# EAGLE design ARC Shield 0.2 (EAGLE 6.4)
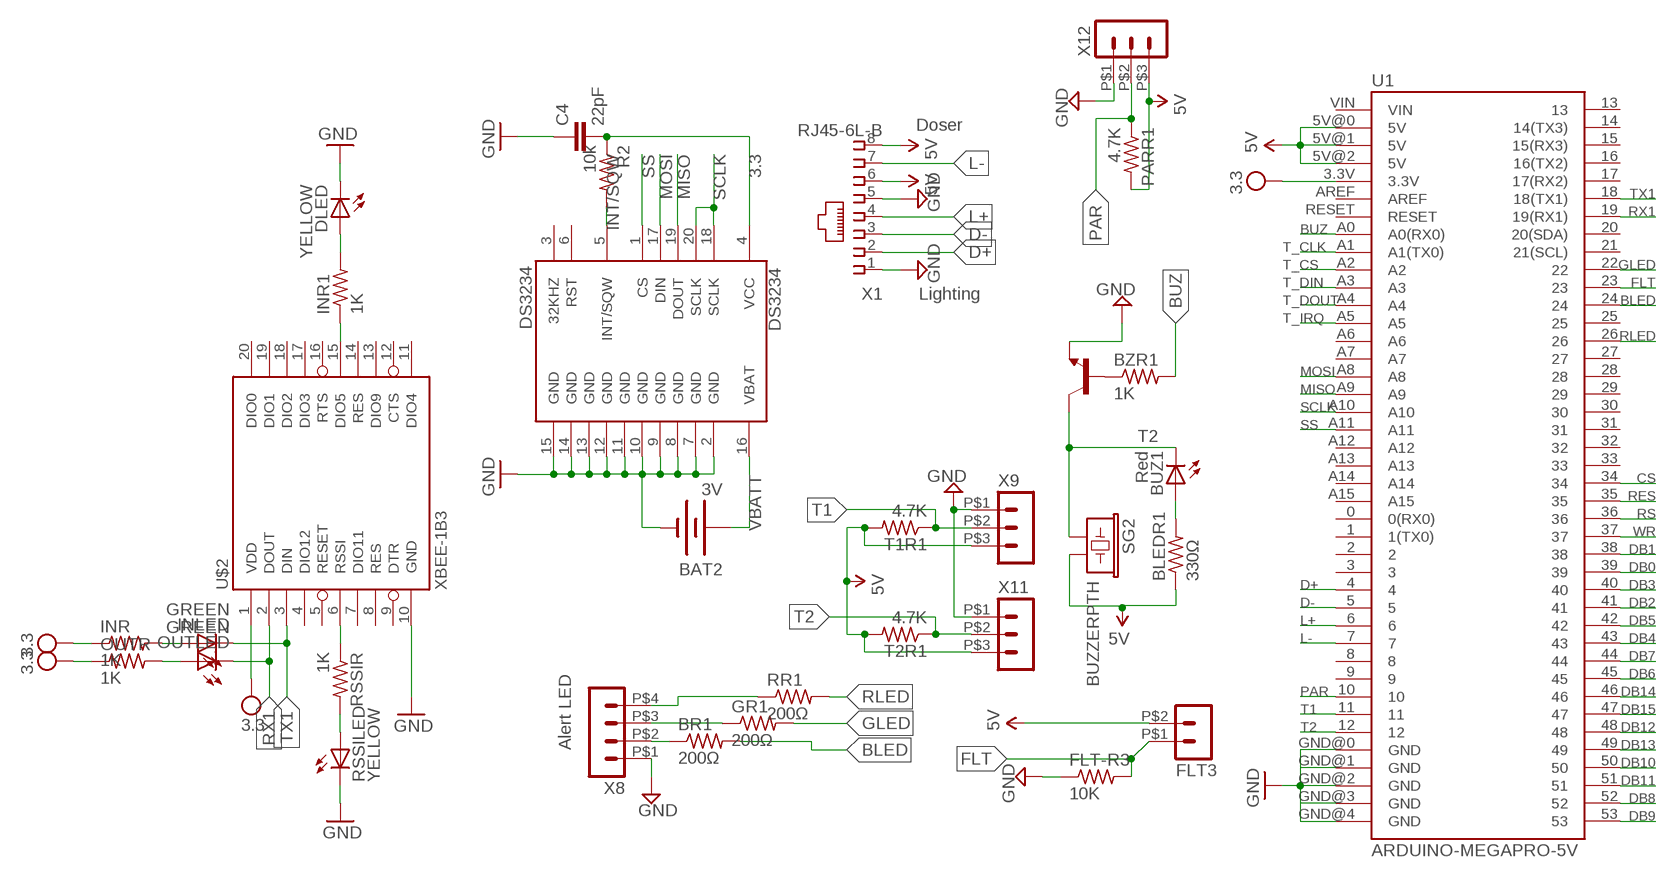
[diagram p0: schematic, sheet 1]

## Parts
BAT2  3V  BATTERY  [BATTCON_12MM_CURVED]
BLEDR1  330Ω  R-US_0204/7  [0204/7]
BR1  200Ω  R-US_0204/7  [0204/7]
BUZ1  Red  LED3MM  [LED3MM]
BZR1  1K  R-US_0204/7  [0204/7]
C4  22pF  C5/3  [C5B3]
DLED  YELLOW  LED3MM  [LED3MM]
DS3234  DS3234  [DS3234]
FLT3  HEADER_POS2_43045-0200  [43045-0200]
FLT-R3  10K  R-US_0204/7  [0204/7]
GR1  200Ω  R-US_0204/7  [0204/7]
INLED  GREEN  LED3MM  [LED3MM]
INR  1K  R-US_0204/7  [0204/7]
INR1  1K  R-US_0204/7  [0204/7]
OUTLED  GREEN  LED3MM  [LED3MM]
OUTR  1K  R-US_0204/7  [0204/7]
PARR1  4.7K  R-US_0204/7  [0204/7]
R2  10k  R-US_0204/7  [0204/7]
RR1  200Ω  R-US_0204/7  [0204/7]
RSSILED  YELLOW  LED3MM  [LED3MM]
RSSIR  1K  R-US_0204/7  [0204/7]
SG2  BUZZERPTH  [BUZZER-12MM]
T1R1  4.7K  R-US_0204/7  [0204/7]
T2  -NPN-TO92  [TO92]
T2R1  4.7K  R-US_0204/7  [0204/7]
U1  ARDUINO-MEGAPRO-5V  [ARDUINO_MEGA-PRO-5V]
U$2  XBEE-1B3  [XBEE-SMD]
X1  RJ45-6L-B  [RJ45-NO-SHIELD]
X8  HEADER_POS4_43045-0401  [43045-0400]
X9  HEADER_POS3_43650-0300  [43650-0300]
X11  HEADER_POS3_43650-0300  [43650-0300]
X12  HEADER_POS3_43650-0300  [43650-0300]

## Nets
3.3: C4.2 DS3234.4(VCC) R2.1 U$2.1(VDD)
5V [1A]: BLEDR1.1 FLT3.P$2 PARR1.2 SG2.- T1R1.2 T2R1.2 U1.5V@0(5V) U1.5V@1(5V) U1.5V@2(5V) X1.6 X1.8 X9.P$3 X11.P$3 X12.P$3
BLED: BR1.2 U1.24
BUZ: BZR1.2 U1.A0(A0(RX0))
CS: U1.34
D+: U1.4 X1.2
D-: U1.5 X1.3
DB0: U1.39
DB1: U1.38
DB2: U1.41
DB3: U1.40
DB4: U1.43
DB5: U1.42
DB6: U1.45
DB7: U1.44
DB8: U1.52
DB9: U1.53
DB10: U1.50
DB11: U1.51
DB12: U1.48
DB13: U1.49
DB14: U1.46
DB15: U1.47
FLT: FLT3.P$1 FLT-R3.2 U1.23
GLED: GR1.2 U1.22
GND [1A]: BAT2.GND(-) C4.1 DLED.K(C) DS3234.2(GND) DS3234.7(GND) DS3234.8(GND) DS3234.9(GND) DS3234.10(GND) DS3234.11(GND) DS3234.12(GND) DS3234.13(GND) DS3234.14(GND) DS3234.15(GND) FLT-R3.1 RSSILED.K(C) T2.1(E) U1.GND@0(GND) U1.GND@1(GND) U1.GND@2(GND) U1.GND@3(GND) U1.GND@4(GND) U$2.10(GND) X1.1 X1.5 X8.P$1 X9.P$1 X11.P$1 X12.P$1
INT/SQW: DS3234.5(INT/SQW) R2.2
L+: U1.6 X1.4
L-: U1.7 X1.7
MISO: DS3234.19(DOUT) U1.A9
MOSI: DS3234.17(DIN) U1.A8
N$1: BR1.1 X8.P$2
N$2: BUZ1.K(C) SG2.+ T2.3(C)
N$3: BZR1.1 T2.2(B)
N$4: RSSIR.1 U$2.6(RSSI)
N$5: GR1.1 X8.P$3
N$6: RSSILED.A RSSIR.2
N$7: RR1.1 X8.P$4
N$11: INLED.A INR.2
N$12: OUTLED.A OUTR.2
N$14: DLED.A INR1.2
N$15: INR1.1 U$2.15(DIO5)
N$19: BLEDR1.2 BUZ1.A
PAR: PARR1.1 U1.10 X12.P$2
RES: U1.35
RLED: RR1.2 U1.26
RS: U1.36
RX1: OUTLED.K(C) U1.19(19(RX1)) U$2.2(DOUT)
SCLK: DS3234.18(SCLK) DS3234.20(SCLK) U1.A10
SS: DS3234.1(CS) U1.A11
T1: T1R1.1 U1.11 X9.P$2
T2: T2R1.1 U1.12 X11.P$2
T_CLK: U1.A1(A1(TX0))
T_CS: U1.A2
T_DIN: U1.A3
T_DOUT: U1.A4
T_IRQ: U1.A5
TX1: INLED.K(C) U1.18(18(TX1)) U$2.3(DIN)
VBATT: BAT2.PWR@1(+) DS3234.16(VBAT)
VCC [1A]: INR.1 OUTR.1 U1.3.3V ; supply symbol labelled 3.3
WR: U1.37
Unconnected: DS3234.3(32KHZ) DS3234.6(RST) U1.0(0(RX0)) U1.1(1(TX0)) U1.2 U1.3 U1.8 U1.9 U1.13 U1.14(14(TX3)) U1.15(15(RX3)) U1.16(16(TX2)) U1.17(17(RX2)) U1.20(20(SDA)) U1.21(21(SCL)) U1.25 U1.27 U1.28 U1.29 U1.30 U1.31 U1.32 U1.33 U1.A6 U1.A7 U1.A12 U1.A13 U1.A14 U1.A15 U1.AREF U1.RESET U1.VIN U$2.4(DIO12) U$2.5(RESET) U$2.7(DIO11) U$2.8(RES) U$2.9(DTR) U$2.11(DIO4) U$2.12(CTS) U$2.13(DIO9) U$2.14(RES) U$2.16(RTS) U$2.17(DIO3) U$2.18(DIO2) U$2.19(DIO1) U$2.20(DIO0)

## Notes on the sheet
- Doser
- Lighting
- Alert LED

## Library data of the parts
BAT2 = SparkFun:BATTERY: Battery Holders Various common sizes : AA, AAA, 20mm coin cell and 12mm coin cell.
BLEDR1 BR1 BZR1 FLT-R3 GR1 INR INR1 OUTR PARR1 R2 RR1 RSSIR T1R1 T2R1 = rcl:R-US_: RESISTOR, American symbol
BUZ1 DLED INLED OUTLED RSSILED = led:LED: LED OSRAM: - CHIPLED LG R971, LG N971, LY N971, LG Q971, LY Q971, LO R971, LY R971 LH N974, LH R974 LS Q976, LO Q976, LY Q976 LO Q996 - Hyper CHIPLED LW Q18S LB Q993, LB Q99A, LB R99A - SideLED LS A670, LO A670, LY A670, LG A670, LP A670 LB A673, LV A673, LT A673, LW A673 LH A674 LY A675 LS A676, LA A676, LO A676, LY A676, LW A676 LS A679, LY A679, LG A679 - Hyper Micro SIDELED® LS Y876, LA Y876, LO Y876, LY Y876 LT Y87S - SmartLED LW L88C, LW L88S LB L89C, LB L89S, LG L890 LS L89K, LO L89K, LY L89K LS L896, LA L896, LO L896, LY L896 - TOPLED LS T670, LO T670, LY T670, LG T670, LP T670 LSG T670, LSP T670, LSY T670, LOP T670, LYG T670 LG T671, LOG T671, LSG T671 LB T673, LV T673, LT T673, LW T673 LH T674 LS T676, LA T676, LO T676, LY T676, LB T676, LH T676, LSB T676, LW T676 LB T67C, LV T67C, LT T67C, LS T67K, LO T67K, LY T67K, LW E67C LS E67B, LA E67B, LO E67B, LY E67B, LB E67C, LV E67C, LT E67C LW T67C LS T679, LY T679, LG T679 LS T770, LO T770, LY T770, LG T770, LP T770 LB T773, LV T773, LT T773, LW T773 LH T774 LS E675, LA E675, LY E675, LS T675 LS T776, LA T776, LO T776, LY T776, LB T776 LHGB T686 LT T68C, LB T68C - Hyper Mini TOPLED® LB M676 - Mini TOPLED Santana® LG M470 LS M47K, LO M47K, LY M47K Source: http://www.osram.convergy.de LUXEON: - LUMILED® LXK2-PW12-R00, LXK2-PW12-S00, LXK2-PW14-U00, LXK2-PW14-V00 LXK2-PM12-R00, LXK2-PM12-S00, LXK2-PM14-U00 LXK2-PE12-Q00, LXK2-PE12-R00, LXK2-PE12-S00, LXK2-PE14-T00, LXK2-PE14-U00 LXK2-PB12-K00, LXK2-PB12-L00, LXK2-PB12-M00, LXK2-PB14-N00, LXK2-PB14-P00, LXK2-PB14-Q00 LXK2-PR12-L00, LXK2-PR12-M00, LXK2-PR14-Q00, LXK2-PR14-R00 LXK2-PD12-Q00, LXK2-PD12-R00, LXK2-PD12-S00 LXK2-PH12-R00, LXK2-PH12-S00 LXK2-PL12-P00, LXK2-PL12-Q00, LXK2-PL12-R00 Source: www.luxeon.com KINGBRIGHT: KA-3528ASYC Source: www.kingbright.com
C4 = capacitor-wima:C: CAPACITOR naming: grid - package width
DS3234 = SparkFun:DS3234: DS3234 Real Time Clock
FLT3 = con-molex-micro-fit-3_0:HEADER_POS2_?: Molex - Micro-Fit 3.0 Series connector, 3.00mm (0.118") pitch header, 2 positions.
SG2 = SparkFun-Electromechanical:BUZZER: Buzzer 12mm Spark Fun Electronics SKU : Comp-Buzzer
T2 = transistor:*-NPN-: NPN Transistror BF959 corrected 2008.03.06
U1 = SparkFun-Boards:ARDUINO-MEGA: Arduino Mega board footprint
U$2 = SparkFun-RF:XBEE-1: Xbee module footprints SMT header is CONN-09042.; PROD_ID: CONN-09042
X1 = con-tycoelectronics:RJ45: CORCOM Modular RJ Jacks No Shield Source: www.tycoelectronics.com .. ENG_DS_1654001_1099_RJ_L_0507.pdf; MPN: RJ45-6L-B; OC_FARNELL: unknown; OC_NEWARK: 16R6090
X8 = con-molex-micro-fit-3_0:HEADER_POS4_?: Molex - Micro-Fit 3.0 Series connector, 3.00mm (0.118") pitch header, 4 positions.
X9 X11 X12 = con-molex-micro-fit-3_0:HEADER_POS3_?: Molex - Micro-Fit 3.0 Series connector, 3.00mm (0.118") pitch header, 3 positions.

## Net classes
0 default: width 0.457 mm, clearance 0.406 mm
2 1A: width 0.66 mm, clearance 0.406 mm

## Board
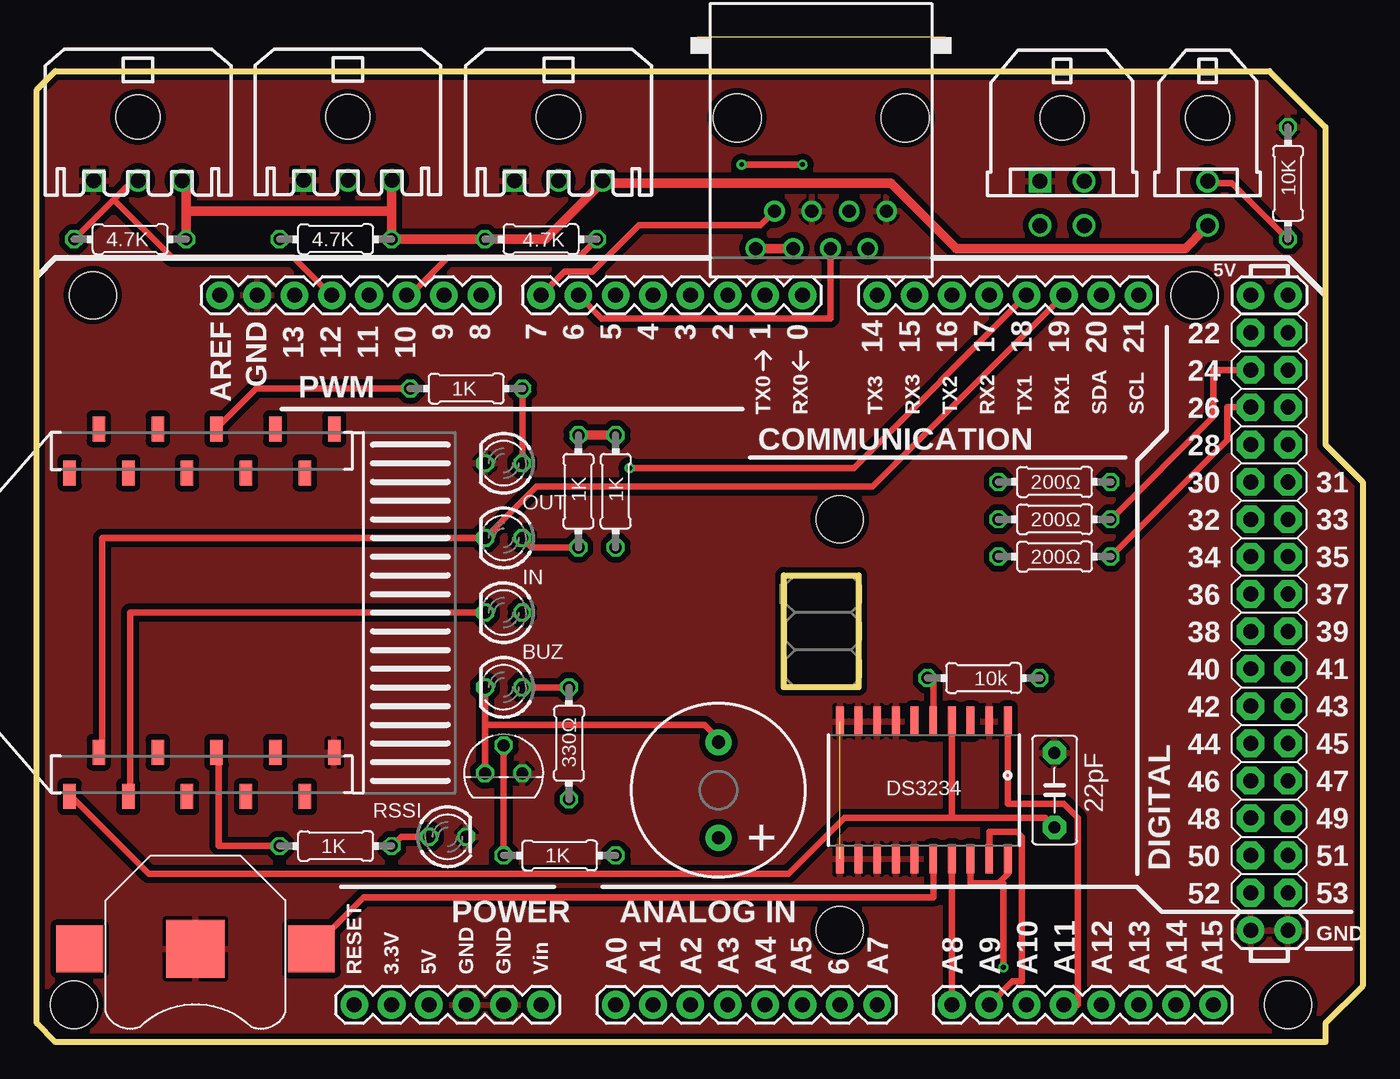
[diagram p1: board, top side]
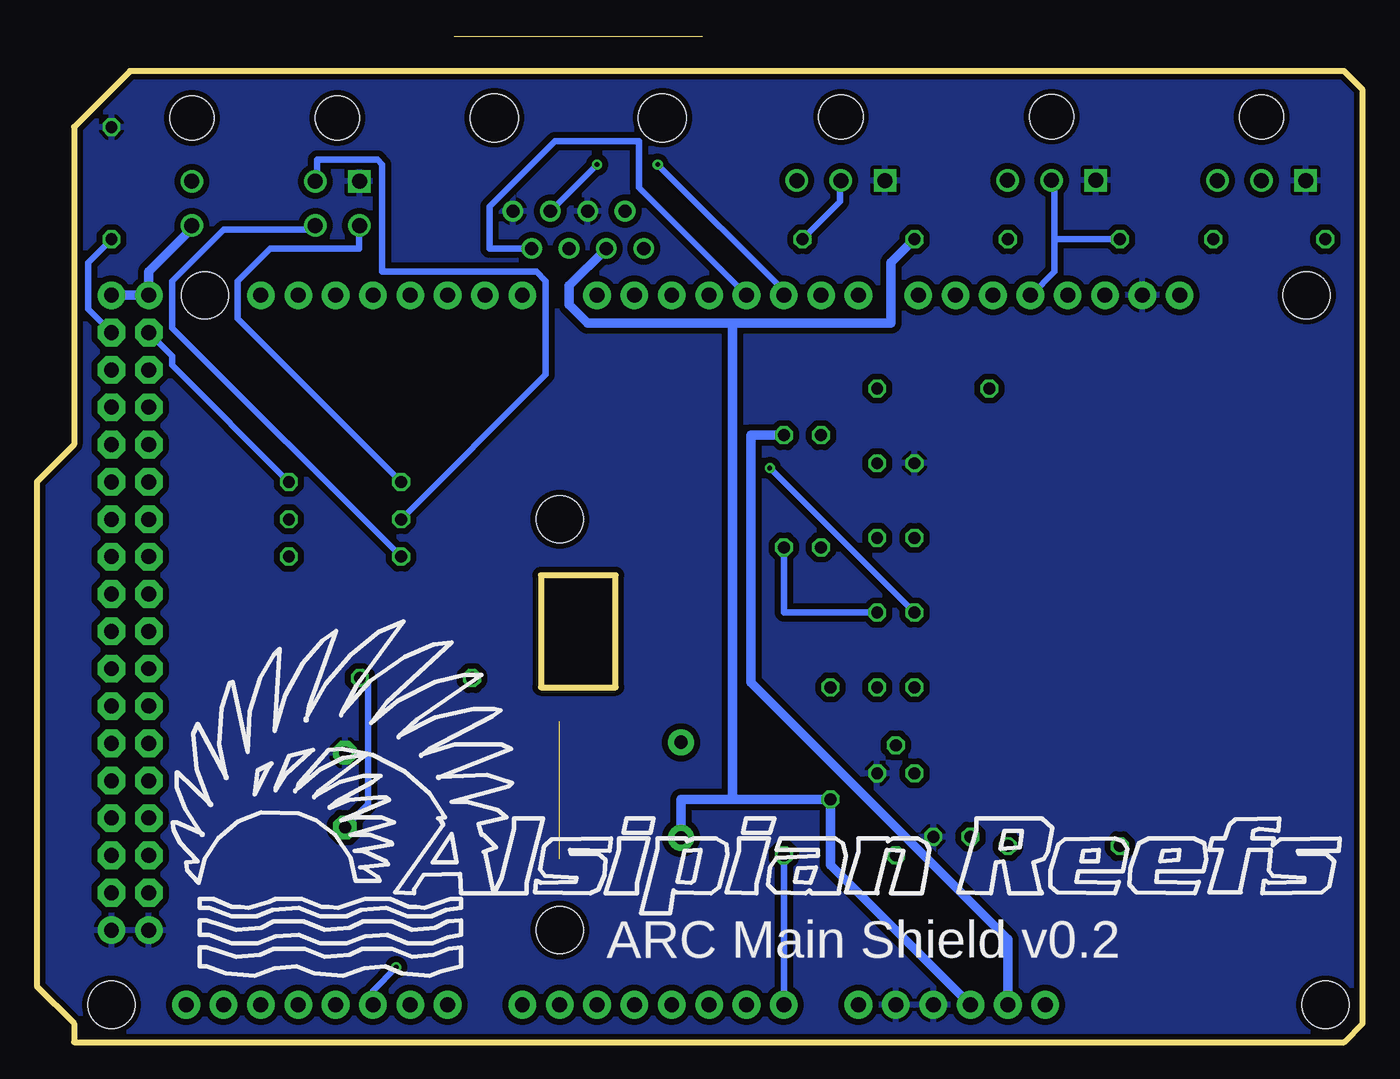
[diagram p2: board, bottom side, seen from below]

Size 90.17 x 66.04 mm. Coordinates in mm from the lower left corner, seen from the top.
Outline: 1.27,0 0,1.27 0,64.77 1.27,66.04 83.82,66.04 87.63,62.23 87.63,40.64 90.17,38.1 90.17,3.81 87.63,1.27 87.63,0 1.27,0
Outline: 50.8,31.75 55.88,31.75 55.88,24.13 50.8,24.13 50.8,31.75
Copper layers (1*16): Top 0.0356mm / dielectric 1.5011mm / Bottom 0.0356mm
Design rules "LaenPCBOrder": minimum track width 6mil, minimum drill 13mil, track to track 6mil, track to pad 6mil, pad to pad 6mil, via to via 6mil, smd to smd 6mil, copper to edge 15mil, drill to drill 6mil, minimum pad ring 7mil, minimum via ring 7mil, stop-mask expansion 3mil, vias tented up to drill 0mil, thermal gap 10mil

### Footprints (pad centres in the part's own frame; a part is rotated, then mirrored left to right if it is on the bottom)
BATTCON_12MM_CURVED = smd 3.962 x 3.962: GND 0,0 | smd 3.175 x 3.175: PWR@1 -7.874,0; PWR@2 7.874,0
0204/7 = drill 0.813 octagon: 1 -3.81,0; 2 3.81,0
LED3MM = drill 0.813 octagon: A -1.27,0; K 1.27,0
C5B3 = drill 0.813 pad 1.6 octagon: 1 -2.54,0; 2 2.54,0
DS3234 = smd 0.53 x 1.98: 1 -5.715,-4.685; 2 -4.445,-4.685; 3 -3.175,-4.685; 4 -1.905,-4.685; 5 -0.635,-4.685; 6 0.635,-4.685; 7 1.905,-4.685; 8 3.175,-4.685; 9 4.445,-4.685; 10 5.715,-4.685; 11 5.715,4.685; 12 4.445,4.685; 13 3.175,4.685; 14 1.905,4.685; 15 0.635,4.685; 16 -0.635,4.685; 17 -1.905,4.685; 18 -3.175,4.685; 19 -4.445,4.685; 20 -5.715,4.685
43045-0200 = drill 1.02: P$1 0,4.32; P$2 0,7.32 | hole 3: 0,0
BUZZER-12MM = drill 0.9 pad 1.778: + 3.25,0; - -3.25,0
TO92 = drill 0.813 octagon: 1 1.27,0; 2 0,1.905; 3 -1.27,0
ARDUINO_MEGA-PRO-5V = drill 1.016 pad 1.88: 0 52.07,50.8; 1 49.53,50.8; 2 46.99,50.8; 3 44.45,50.8; 3.3V 24.13,2.54; 4 41.91,50.8; 5 39.37,50.8; 5V@0 26.67,2.54; 5V@1 82.55,50.8; 5V@2 85.09,50.8; 6 36.83,50.8; 7 34.29,50.8; 8 30.226,50.8; 9 27.686,50.8; 10 25.146,50.8; 11 22.606,50.8; 12 20.066,50.8; 13 17.526,50.8; 14 57.15,50.8; 15 59.69,50.8; 16 62.23,50.8; 17 64.77,50.8; 18 67.31,50.8; 19 69.85,50.8; 20 72.39,50.8; 21 74.93,50.8; A0 39.37,2.54; A1 41.91,2.54; A2 44.45,2.54; A3 46.99,2.54; A4 49.53,2.54; A5 52.07,2.54; A6 54.61,2.54; A7 57.15,2.54; A8 62.23,2.54; A9 64.77,2.54; A10 67.31,2.54; A11 69.85,2.54; A12 72.39,2.54; A13 74.93,2.54; A14 77.47,2.54; A15 80.01,2.54; AREF 12.446,50.8; GND@0 29.21,2.54; GND@1 31.75,2.54; GND@2 82.55,7.62; GND@3 85.09,7.62; GND@4 14.986,50.8; RESET 21.59,2.54; VIN 34.29,2.54 | drill 1.016 pad 1.88 octagon: 22 82.55,48.26; 23 85.09,48.26; 24 82.55,45.72; 25 85.09,45.72; 26 82.55,43.18; 27 85.09,43.18; 28 82.55,40.64; 29 85.09,40.64; 30 82.55,38.1; 31 85.09,38.1; 32 82.55,35.56; 33 85.09,35.56; 34 82.55,33.02; 35 85.09,33.02; 36 82.55,30.48; 37 85.09,30.48; 38 82.55,27.94; 39 85.09,27.94; 40 82.55,25.4; 41 85.09,25.4; 42 82.55,22.86; 43 85.09,22.86; 44 82.55,20.32; 45 85.09,20.32; 46 82.55,17.78; 47 85.09,17.78; 48 82.55,15.24; 49 85.09,15.24; 50 82.55,12.7; 51 85.09,12.7; 52 82.55,10.16; 53 85.09,10.16 | hole 3.2: 3.81,50.8; 2.54,2.54; 54.61,35.56; 54.61,7.62; 78.74,50.8; 85.09,2.54
XBEE-SMD = smd 1.7 x 0.85: 1 -12.5,20; 2 -9.5,18; 3 -12.5,16; 4 -9.5,14; 5 -12.5,12; 6 -9.5,10; 7 -12.5,8; 8 -9.5,6; 9 -12.5,4; 10 -9.5,2; 11 12.5,2; 12 9.5,4; 13 12.5,6; 14 9.5,8; 15 12.5,10; 16 9.5,12; 17 12.5,14; 18 9.5,16; 19 12.5,18; 20 9.5,20
RJ45-NO-SHIELD = drill 0.9 pad 1.4: 1 -4.445,6.35; 2 -3.175,8.89; 3 -1.905,6.35; 4 -0.635,8.89; 5 0.635,6.35; 6 1.905,8.89; 7 3.175,6.35; 8 4.445,8.89 | hole 3.251: -5.715,0; 5.715,0
43045-0400 = drill 1.02 square: P$1 1.5,4.32 | drill 1.02: P$2 -1.5,4.32; P$3 1.5,7.32; P$4 -1.5,7.32 | hole 3: 0,0
43650-0300 = drill 1.02 square: P$1 3,4.32 | drill 1.02: P$2 0,4.32; P$3 -3,4.32 | hole 3: 0,0

### Placement (x,y rotation side)
BAT2  10.79,6.35 180 top
BLEDR1  36.2,20.32 90 top
BR1  69.22,35.56 0 top
BUZ1  31.75,24.13 180 top
BZR1  35.56,12.7 0 top
C4  69.22,17.14 270 top
DLED  31.75,39.37 180 top
DS3234  60.33,17.14 180 top
FLT3  79.63,62.87 180 top
FLT-R3  85.09,58.42 270 top
GR1  69.22,38.1 0 top
INLED  31.75,29.21 180 top
INR  39.37,37.47 270 top
INR1  29.21,44.45 0 top
OUTLED  31.75,34.29 180 top
OUTR  36.83,37.47 270 top
PARR1  34.29,54.61 180 top
R2  64.39,24.77 180 top
RR1  69.22,33.02 0 top
RSSILED  27.94,13.97 0 top
RSSIR  20.32,13.34 0 top
SG2  46.35,17.14 90 top
T1R1  20.32,54.61 0 top
T2  31.75,18.29 0 top
T2R1  6.35,54.61 0 top
U1  0,0 0 top
U$2  22.23,29.21 90 top
X1  53.34,62.87 180 top
X8  69.72,62.87 180 top
X9  21.16,62.94 180 top
X11  6.88,62.92 180 top
X12  35.48,62.92 180 top

### Tracks (layer width: path | path; a pad name or v marks a point on that pad's centre or on a via)
3.3
  Top 0.457: 62.23,15.24 68.58,15.24 C4.2 | 62.23,15.24 54.93,15.24 51.12,11.43 7.62,11.43 2.54,16.51 U$2.1 | 62.23,15.24 DS3234.4
  Bottom 0.457: C4.2 67.63,16.19 67.63,24.45 67.94,24.77 R2.1
5V
  Top 0.66: 10.16,56.52 10.16,58.42 X11.P$3 | 10.16,56.52 T2R1.2 | X1.6 X1.8 | 24.13,56.52 24.13,58.42 X9.P$3 | 24.13,56.52 T1R1.2 PARR1.2 34.61,54.61 38.42,58.42 X12.P$3 38.73,58.42 58.1,58.42 62.55,53.98 78.11,53.98 79.38,55.24 FLT3.P$2 | 24.13,56.52 10.16,56.52
  Bottom 0.66: 42.86,16.51 46.35,16.51 SG2.- | 42.86,16.51 BLEDR1.1 36.2,12.06 U1.5V@0 | FLT3.P$2 79.69,55.24 82.55,52.39 U1.5V@1 U1.5V@2 | X1.6 53.98,51.44 53.98,50.16 52.7,48.9 42.86,48.9 | 42.86,48.9 32.07,48.9 32.07,53.02 PARR1.2 | 42.86,48.9 42.86,16.51
BLED
  Top 0.457: BR1.2 80.01,42.55 80.01,45.72 U1.24
BUZ
  Bottom 0.457: U1.A0 BZR1.2
D+
  Bottom 0.457: X1.2 59.37,53.98 59.37,56.83 54.93,61.28 49.21,61.28 49.21,58.1 U1.4
D-  (via drill 0.33)
  Top 0.457: v47.94,59.69 v52.07,59.69
  Bottom 0.457: v52.07,59.69 X1.3 | v47.94,59.69 39.37,51.12 U1.5
FLT
  Top 0.457: FLT-R3.2 81.28,58.42 79.69,58.42 FLT3.P$1
  Bottom 0.457: U1.23 86.68,49.85 86.68,53.02 FLT-R3.2
GLED
  Bottom 0.457: GR1.2 80.96,46.04 80.96,46.67 U1.22
GND  (1 unrouted)
  pour Top: 0,1.27 0,64.77 1.27,66.04 83.82,66.04 87.63,62.23 87.63,40.64 90.17,38.1 90.17,3.81 87.63,1.27 87.63,0 1.27,0
  pour Bottom: 1.27,66.04 83.82,66.04 87.63,62.23 87.63,40.64 90.17,38.1 90.17,3.81 87.63,1.27 87.63,0 1.27,0 0,1.27 0,64.77
INT/SQW
  Top 0.457: DS3234.5 60.96,24.77 R2.2
L+
  Top 0.457: X1.4 53.98,49.21 38.42,49.21 U1.6
L-
  Top 0.457: X1.7 49.21,55.56 40.96,55.56 37.78,52.39 35.88,52.39 U1.7
MISO
  Top 0.457: DS3234.19 64.77,14.29 66.67,14.29 66.99,13.97 66.99,4.13 66.36,4.13 U1.A9
MOSI
  Top 0.457: U1.A8 DS3234.17
N$1
  Bottom 0.457: BR1.1 55.56,45.4 55.56,51.75 56.2,52.39 66.67,52.39 66.67,59.69 66.99,60.01 71.12,60.01 71.12,58.74 X8.P$2
N$2
  Top 0.457: BUZ1.K 30.48,21.59 | 30.48,21.59 T2.3 | 30.48,21.59 45.4,21.59 46.35,20.64 SG2.+
N$3
  Top 0.457: T2.2 BZR1.1
N$4
  Top 0.457: RSSIR.1 12.38,13.34 12.38,19.68 U$2.6
N$5
  Bottom 0.457: GR1.1 76.52,49.21 76.52,51.75 74.3,53.98 68.26,53.98 68.26,55.24 X8.P$3
N$6
  Top 0.457: RSSIR.2 24.77,13.97 RSSILED.A
N$7
  Bottom 0.457: RR1.1 80.96,48.58 80.96,51.75 77.47,55.24 71.44,55.24 X8.P$4
N$11
  Bottom 0.457: INLED.A 39.37,29.21 INR.2
N$12
  Top 0.457: OUTLED.A 33.66,33.66 OUTR.2
N$14
  Top 0.457: INR1.2 DLED.A
N$15
  Top 0.457: INR1.1 14.92,44.45 12.38,41.91 U$2.15
N$19
  Top 0.457: BLEDR1.2 BUZ1.A
PAR
  Top 0.457: PARR1.1 36.83,53.34 27.94,53.34 25.4,50.8 U1.10
  Bottom 0.457: PARR1.1 35.56,57.15 35.56,58.42 X12.P$2
RLED
  Top 0.457: RR1.2 80.96,40.96 80.96,43.18 U1.26
RX1
  Top 0.457: U$2.2 4.45,20 4.45,34.29 OUTLED.K 33.97,37.78 56.83,37.78 U1.19
SCLK  (via drill 0.33)
  Top 0.457: DS3234.18 63.5,10.79 65.41,10.79 65.56,10.95 | 65.56,10.95 66.04,11.43 DS3234.20 | v65.72,5.08 65.72,10.79 65.56,10.95
  Bottom 0.457: v65.72,5.08 67.31,3.49 U1.A10
SS
  Top 0.457: DS3234.1 66.04,16.19 69.85,16.19 70.8,15.24 70.8,2.54 U1.A11
T1
  Bottom 0.457: 20.95,54.61 T1R1.1 | 20.95,54.61 20.95,58.42 X9.P$2 | 20.95,54.61 20.95,52.39 22.54,50.8 U1.11
T2
  Top 0.457: 5.24,57.31 6.35,58.42 6.67,58.42 X11.P$2 | 5.24,57.31 T2R1.1 | 5.24,57.31 9.21,53.34 17.46,53.34 20,50.8 U1.12
TX1  (via drill 0.33)
  Top 0.457: INLED.K 6.35,29.21 6.35,16.83 U$2.3 | U1.18 55.56,39.05 v40.32,39.05
  Bottom 0.457: INLED.K v40.32,39.05
VBATT
  Top 0.457: DS3234.16 60.96,9.84 22.23,9.84 18.73,6.35 BAT2.PWR@1
VCC
  Top 0.66: INR.1 OUTR.1
  Bottom 0.66: INR.1 41.59,41.27 41.59,24.45 24.13,6.99 U1.3.3V

### Text on the board
tPlace: OUT | IN | BUZ | RSSI | +
bPlace: ARC Main Shield v0.2